# Altium schematic sheet sch_output.SchDoc
size A4
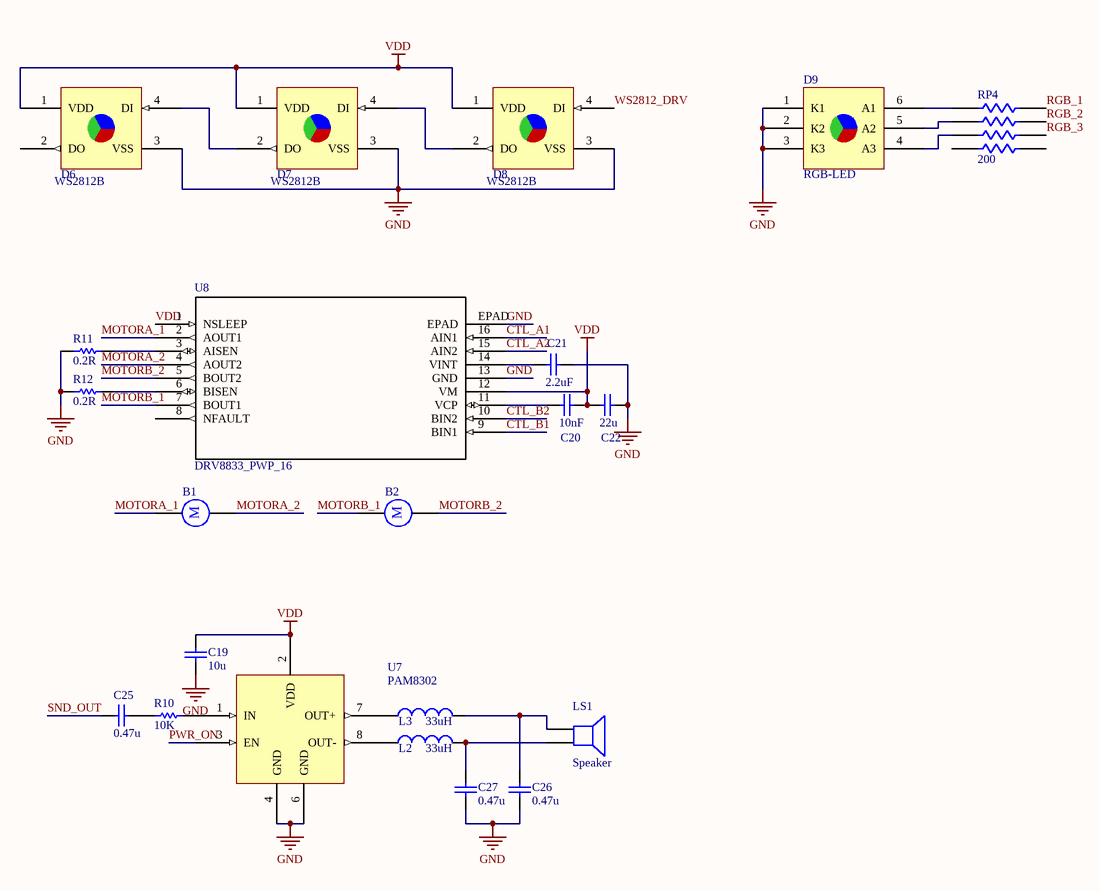
[diagram p0: sch_output.SchDoc]

## Parts
B1  Motor  [RB5-10.5]  (value not drawn)
B2  Motor  [RB5-10.5]  (value not drawn)
C19  value 10u  [C-2012[0805]]  (hidden comment: Cap Semi)
C20  value 10nF  [C-1608[0603]]  (hidden comment: Cap Semi)
C21  value 2.2uF  [C-1608[0603]]  (hidden comment: Cap Semi)
C22  value 22u  [C-2012[0805]]  (hidden comment: Cap Semi)
C25  value 0.47u  [C-1608[0603]]  (hidden comment: Cap Semi)
C26  value 0.47u  [C-1608[0603]]  (hidden comment: Cap Semi)
C27  value 0.47u  [C-1608[0603]]  (hidden comment: Cap Semi)
D6  WS2812B  [LED-5050-4]
D7  WS2812B  [LED-5050-4]
D8  WS2812B  [LED-5050-4]
D9  RGB-LED  [LED-5050-6]
L2  value 33uH  [L-1608[0603]]  (hidden comment: Inductor)
L3  value 33uH  [L-1608[0603]]  (hidden comment: Inductor)
LS1  Speaker  [PIN2]
R10  value 10K  [R-1608[0603]]  (hidden comment: Res Semi)
R11  value 0.2R  [R-3216[1206]]  (hidden comment: Res Semi)
R12  value 0.2R  [R-3216[1206]]  (hidden comment: Res Semi)
RP4  200  [R0603x4]
U7  PAM8302  [SOP8-3D]
U8  DRV8833_PWP_16  [PWP16_2P31X2P46]

## Nets
GND: C19.1 C21.1 C22.2 C26.2 C27.2 D6.3(VSS) D7.3(VSS) D8.3(VSS) D9.1(K1) D9.2(K2) D9.3(K3) R11.1 R12.1 U7.4(GND) U7.6(GND) U8.13(GND) U8.EPAD
VDD: C19.2 C20.1 C22.1 D6.1(VDD) D7.1(VDD) D8.1(VDD) U7.2(VDD) U8.1(NSLEEP) U8.12(VM)
CTL_A1: U8.16(AIN1)
CTL_A2: U8.15(AIN2)
CTL_B1: U8.9(BIN1)
CTL_B2: U8.10(BIN2)
MOTORA_1: B1.1 U8.2(AOUT1)
MOTORA_2: B1.2 U8.4(AOUT2)
MOTORB_1: B2.1 U8.7(BOUT1)
MOTORB_2: B2.2 U8.5(BOUT2)
PWR_ON: U7.3(EN)
RGB_1: RP4.8
RGB_2: RP4.7
RGB_3: RP4.6
SND_OUT: C25.2
WS2812_DRV: D8.4(DI)
NetC20_2: C20.2 U8.11(VCP)
NetC21_2: C21.2 U8.14(VINT)
NetC25_1: C25.1 R10.2
NetC26_1: C26.1 L3.2 LS1.1
NetC27_1: C27.1 L2.2 LS1.2
NetD6_4: D6.4(DI) D7.2(DO)
NetD7_4: D7.4(DI) D8.2(DO)
NetD9_4: D9.4(A3) RP4.3
NetD9_5: D9.5(A2) RP4.2
NetD9_6: D9.6(A1) RP4.1
NetL2_1: L2.1 U7.8(OUT-)
NetL3_1: L3.1 U7.7(OUT+)
NetR10_1: R10.1 U7.1(IN)
NetR11_2: R11.2 U8.3(AISEN)
NetR12_2: R12.2 U8.6(BISEN)

Not connected (* = marked no-connect by the designer): D6 2(DO); RP4 4 5; U8 8(NFAULT)

## Notes on the sheet
- (in symbol Motor) M

## Library data of the parts
B1 B2 = Motor: Motor, General Kind; Published: 24-Mar-1999; LatestRevisionDate: 17-Jul-2002; LatestRevisionNote: Re-released for DXP Platform.; PackageReference: RB5-10.5; Publisher: Altium Limited; PackageDescription: Capacitor (Radial); 2 Leads
C19-C22 C25-C27 = Cap Semi: Capacitor (Semiconductor SIM Model); Published: 8-Jun-2000; PackageReference: C1206; Publisher: Altium Limited
  C19 C22: LatestRevisionDate: 29-May-2009; LatestRevisionNote: IPC-7351 Footprint Added.; PackageDescription: Chip Capacitor
  C20 C21 C25-C27: LatestRevisionDate: 17-Jul-2002; LatestRevisionNote: Re-released for DXP Platform.
D9 = RGBLED
L2 L3 = Inductor: Code_IEC: 1005; Published: 8-Jun-2000; LatestRevisionDate: 17-Jul-2002; LatestRevisionNote: Re-released for DXP Platform.; PackageReference: 0402-A; Publisher: Altium Limited; Code_JEITA: 0402
LS1 = Speaker: Loudspeaker; Published: 24-Mar-1999; LatestRevisionDate: 17-Jul-2002; LatestRevisionNote: Re-released for DXP Platform.; PackageReference: PIN2; Publisher: Altium Limited
R10-R12 = Res Semi: Semiconductor Resistor; Published: 8-Jun-2000; LatestRevisionDate: 17-Jul-2002; LatestRevisionNote: Re-released for DXP Platform.; PackageReference: AXIAL-0.5; Publisher: Altium Limited
RP4 = RPACK4
U8 = DRV8833_PWP_16: Imported; Manufacturer: Texas Instruments; INDUSTRY_STD_PKG_TYPE: HTSSOP; FAMILY_NAME: BRUSHED DC DRIVER; PIN_COUNT: 16; PACKAGE_DESIGNATOR: PWP; Datasheet URL: http://www.ti.com/lit/gpn/DRV8833; GENERIC_PART_NUMBER: DRV8833; Vendor: Texas Instruments; Manufacturer_Part_Number: drv8833_pwp_16; RefDes: RefDes; Type: DEV; Value: Value